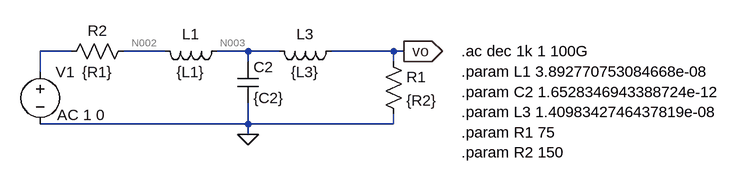
[diagram p0: schematic ejercicio3_desnormalizado.asc]
ejercicio3_desnormalizado.asc, the LTspice schematic file:
Version 4
SHEET 1 956 680
WIRE -80 112 -128 112
WIRE 64 112 0 112
WIRE 192 112 144 112
WIRE 240 112 192 112
WIRE 416 112 320 112
WIRE 432 112 416 112
WIRE 192 128 192 112
WIRE 416 128 416 112
WIRE -128 144 -128 112
WIRE 192 224 192 192
WIRE 192 224 -128 224
WIRE 416 224 416 208
WIRE 416 224 192 224
WIRE 192 240 192 224
FLAG 192 240 0
FLAG 432 112 vo
IOPIN 432 112 Out
SYMBOL ind 160 96 R90
WINDOW 0 5 56 VBottom 2
WINDOW 3 32 56 VTop 2
SYMATTR InstName L1
SYMATTR Value {L1}
SYMBOL ind 336 96 R90
WINDOW 0 5 56 VBottom 2
WINDOW 3 32 56 VTop 2
SYMATTR InstName L3
SYMATTR Value {L3}
SYMBOL cap 176 128 R0
SYMATTR InstName C2
SYMATTR Value {C2}
SYMBOL res 400 112 R0
SYMATTR InstName R1
SYMATTR Value {R2}
SYMBOL res 16 96 R90
WINDOW 0 0 56 VBottom 2
WINDOW 3 32 56 VTop 2
SYMATTR InstName R2
SYMATTR Value {R1}
SYMBOL voltage -128 128 R0
WINDOW 3 26 82 Left 2
SYMATTR Value AC 1 0
SYMATTR InstName V1
TEXT 520 112 Left 2 !.ac dec 1k 1 100G\n.param L1 3.892770753084668e-08\n.param C2 1.6528346943388724e-12\n.param L3 1.4098342746437819e-08\n.param R1 75\n.param R2 150

The netlist it stands for:
* ejercicio3_desnormalizado.asc
L1 N003 N002 {L1}
L3 vo N003 {L3}
C2 N003 0 {C2}
R1 vo 0 {R2}
R2 N002 N001 {R1}
V1 N001 0 AC 1 0
.ac dec 1k 1 100G
.param L1 3.892770753084668e-08
.param C2 1.6528346943388724e-12
.param L3 1.4098342746437819e-08
.param R1 75
.param R2 150
.backanno
.end

* Results of the author's LTspice run, read from the files saved beside the schematic
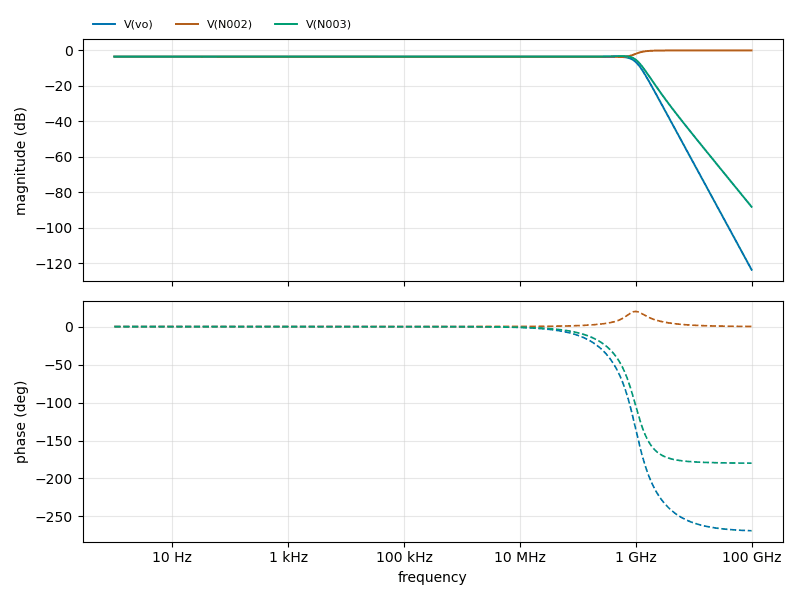
[diagram p1: AC Analysis of ejercicio3_desnormalizado.asc, plotted from the saved traces]
* AC Analysis, 1 run:
*   V(vo): -3.52 dB at 1 Hz, -123.52 dB at 100 GHz, peak -3.52 dB at 45.39 MHz, 3 dB below the peak at 1 GHz
*   V(N002): -3.52 dB at 1 Hz, -0.00 dB at 100 GHz, peak -0.00 dB at 100 GHz, 3 dB below the peak at 806.7 MHz
*   V(N003): -3.52 dB at 1 Hz, -88.10 dB at 100 GHz, peak -3.20 dB at 572.8 MHz, 3 dB below the peak at 1.084 GHz